# Altium schematic sheet Sockets.SchDoc
size A4
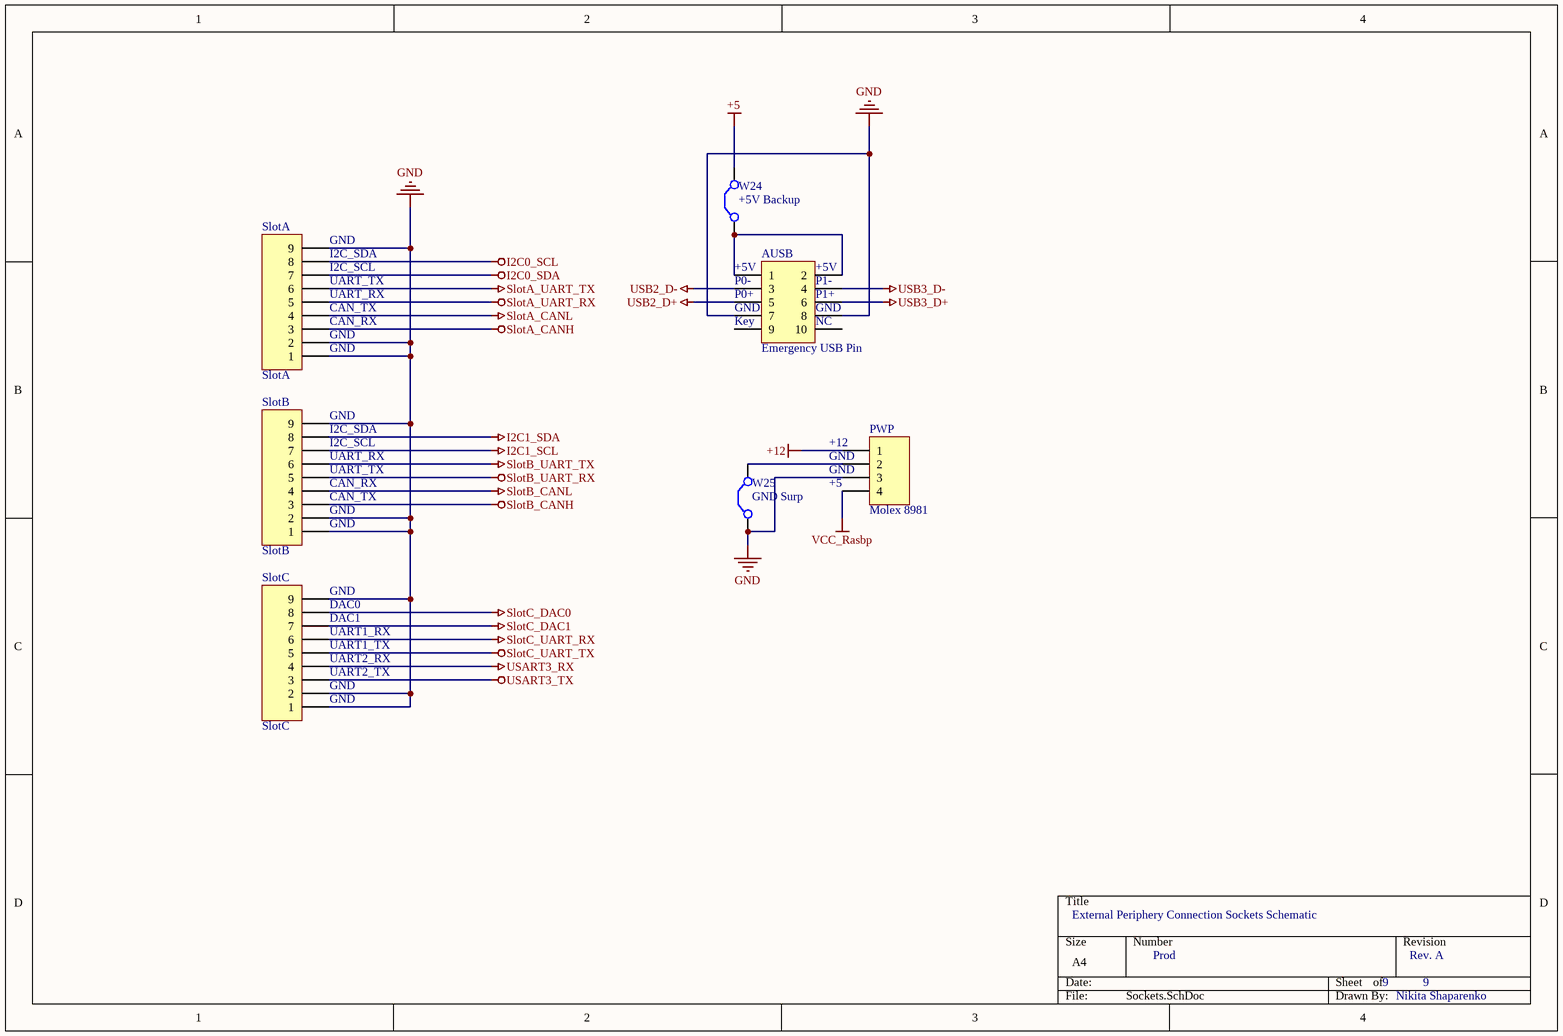
[diagram p0: Sockets.SchDoc]

## Parts
AUSB  Emergency USB Pin  [HDR2X5]
PWP  Molex 8981  [HDR1X4]
SlotA  SlotA  [SATA Socket]
SlotB  SlotB  [SATA Socket]
SlotC  SlotC  [SATA Socket]
W24  +5V Backup  [RAD-0.1]
W25  GND Surp  [RAD-0.1]

## Nets
+5: W24.2(C2)
+12: PWP.1
GND: AUSB.7 AUSB.8 PWP.3 SlotA.1 SlotA.2 SlotA.9 SlotB.1 SlotB.2 SlotB.9 SlotC.1 SlotC.2 SlotC.9 W25.1(C1)
I2C0_SCL: SlotA.8
I2C0_SDA: SlotA.7
I2C1_SCL: SlotB.7
I2C1_SDA: SlotB.8
SlotA_CANH: SlotA.3
SlotA_CANL: SlotA.4
SlotA_UART_RX: SlotA.5
SlotA_UART_TX: SlotA.6
SlotB_CANH: SlotB.3
SlotB_CANL: SlotB.4
SlotB_UART_RX: SlotB.5
SlotB_UART_TX: SlotB.6
SlotC_DAC0: SlotC.8
SlotC_DAC1: SlotC.7
SlotC_UART_RX: SlotC.6
SlotC_UART_TX: SlotC.5
USART3_RX: SlotC.4
USART3_TX: SlotC.3
USB2_D+: AUSB.5
USB2_D-: AUSB.3
USB3_D+: AUSB.6
USB3_D-: AUSB.4
VCC_Rasbp: PWP.4
NetAUSB_1: AUSB.1 AUSB.2 W24.1(C1)
NetPWP_2: PWP.2 W25.2(C2)

Not connected (* = marked no-connect by the designer): AUSB 9 10

## Notes on the sheet
- (near SlotA) GND
- (near SlotA) I2C_SDA
- (near SlotA) I2C_SCL
- (near SlotA) UART_TX
- (near SlotA) UART_RX
- (near SlotA) CAN_TX
- (near AUSB) +5V
- (near AUSB) P0-
- (near AUSB) P0+
- (near AUSB) GND
- (near AUSB) P1-
- (near AUSB) P1+
- (near SlotA) CAN_RX
- (near AUSB) Key
- (near AUSB) NC
- (near SlotB) GND
- (near SlotB) I2C_SDA
- (near SlotB) I2C_SCL
- (near PWP) +12
- (near SlotB) UART_TX
- (near SlotB) UART_RX
- (near SlotB) CAN_TX
- (near SlotB) CAN_RX
- (near PWP) GND
- (near PWP) +5
- (near SlotC) GND
- (near SlotC) DAC0
- (near SlotC) DAC1
- (near SlotC) UART1_TX
- (near SlotC) UART1_RX
- (near SlotC) UART2_TX
- (near SlotC) UART2_RX
- External Periphery Connection Sockets Schematic
- Prod
- 9
- Rev. A
- Nikita Shaparenko

## Library data of the parts
AUSB = Header 5X2: Header, 5-Pin, Dual row; LatestRevisionDate: 17-Jul-2002; LatestRevisionNote: Re-released for DXP Platform.; Publisher: Altium Limited
PWP = Header 4: Header, 4-Pin; LatestRevisionDate: 17-Jul-2002; LatestRevisionNote: Re-released for DXP Platform.; Publisher: Altium Limited
SlotA SlotB SlotC = Header 9: Header, 9-Pin; LatestRevisionDate: 17-Jul-2002; LatestRevisionNote: Re-released for DXP Platform.; Publisher: Altium Limited
W24 W25 = Jumper: Jumper Wire; Published: 24-Mar-1999; LatestRevisionDate: 17-Jul-2002; LatestRevisionNote: Re-released for DXP Platform.; PackageReference: RAD-0.2; Publisher: Altium Limited; PackageDescription: Radial Cap, Thru-Hole; 2 Leads; 0.2 in Pin Spacing